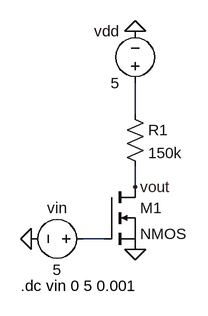
[diagram p0: schematic Draft4.asc]
Draft4.asc, the LTspice schematic file:
Version 4.1
SHEET 1 880 680
WIRE 128 0 128 -48
WIRE 128 112 128 80
WIRE 80 192 48 192
FLAG 128 -128 0
FLAG -32 192 0
FLAG 128 208 0
FLAG 128 112 vout
SYMBOL nmos 80 112 R0
SYMATTR InstName M1
SYMBOL voltage 128 -32 R180
WINDOW 0 24 96 Left 2
WINDOW 3 24 16 Left 2
SYMATTR InstName vdd
SYMATTR Value 5
SYMBOL res 112 -16 R0
SYMATTR InstName R1
SYMATTR Value 150k
SYMBOL voltage 64 192 M270
WINDOW 0 32 56 VTop 2
WINDOW 3 -32 56 VBottom 2
SYMATTR InstName vin
SYMATTR Value 5
TEXT -48 264 Left 2 !.dc vin 0 5 0.001

The netlist it stands for:
* Draft4.asc
M1 vout N002 0 0 NMOS
vdd N001 0 5
R1 N001 vout 150k
vin N002 0 5
.model NMOS NMOS
.model PMOS PMOS
.lib standard.mos
.dc vin 0 5 0.001
.backanno
.end